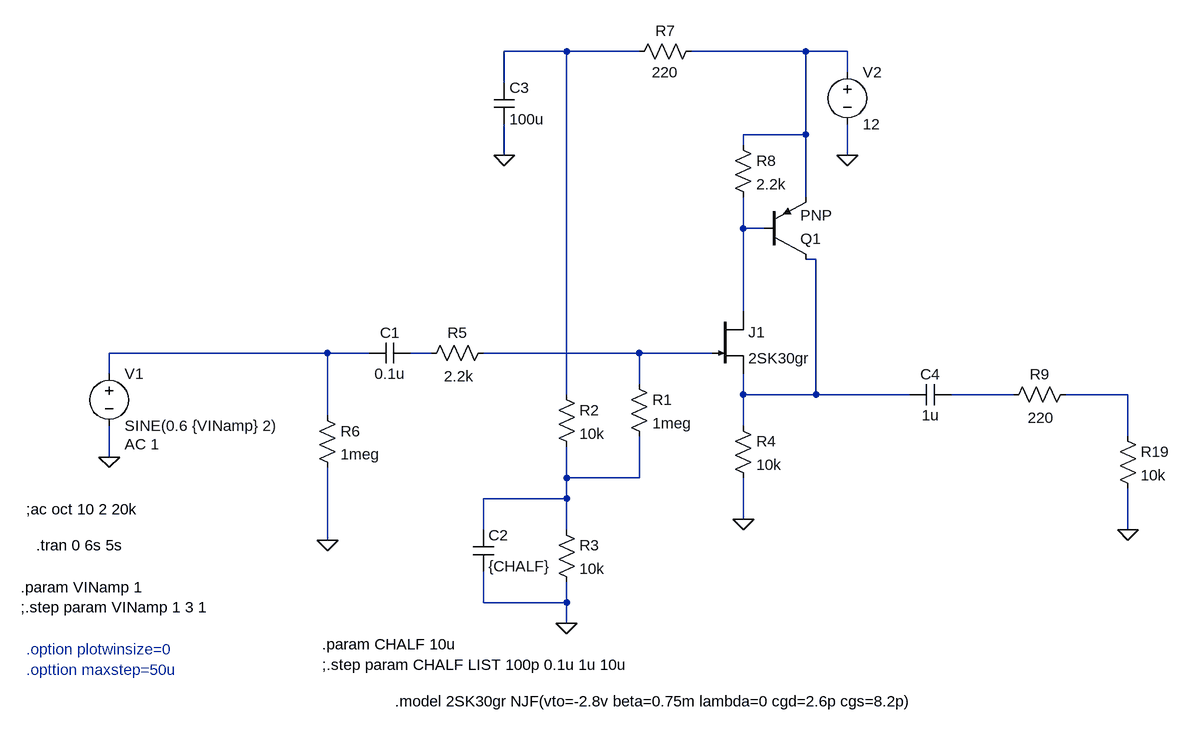
[diagram p0: schematic PTBS-1 Buffer.asc]
PTBS-1 Buffer.asc, the LTspice schematic file:
Version 4
SHEET 1 1708 4196
WIRE -432 1904 -528 1904
WIRE -320 1904 -432 1904
WIRE -64 1904 -240 1904
WIRE 0 1904 -64 1904
WIRE 0 1936 0 1904
WIRE -528 1952 -528 1904
WIRE -64 2032 -64 1904
WIRE -64 2032 -160 2032
WIRE -160 2048 -160 2032
WIRE -528 2064 -528 2016
WIRE 0 2064 0 2016
WIRE -64 2128 -64 2032
WIRE -160 2176 -160 2128
WIRE -128 2176 -160 2176
WIRE -48 2224 -64 2224
WIRE -160 2304 -160 2176
WIRE -800 2368 -1136 2368
WIRE -736 2368 -800 2368
WIRE -640 2368 -672 2368
WIRE -320 2368 -560 2368
WIRE -208 2368 -320 2368
WIRE -1136 2400 -1136 2368
WIRE -320 2416 -320 2368
WIRE -432 2432 -432 1904
WIRE -160 2432 -160 2400
WIRE -48 2432 -48 2224
WIRE -48 2432 -160 2432
WIRE 96 2432 -48 2432
WIRE 256 2432 160 2432
WIRE 432 2432 336 2432
WIRE -800 2464 -800 2368
WIRE -160 2480 -160 2432
WIRE 432 2496 432 2432
WIRE -1136 2528 -1136 2480
WIRE -432 2560 -432 2512
WIRE -320 2560 -320 2496
WIRE -320 2560 -432 2560
WIRE -432 2592 -432 2560
WIRE -432 2592 -560 2592
WIRE -160 2624 -160 2560
WIRE -560 2640 -560 2592
WIRE -432 2640 -432 2592
WIRE 432 2640 432 2576
WIRE -800 2656 -800 2544
WIRE -560 2752 -560 2704
WIRE -432 2752 -432 2720
WIRE -432 2752 -560 2752
WIRE -432 2784 -432 2752
FLAG -160 2624 0
FLAG -432 2784 0
FLAG 0 2064 0
FLAG 432 2640 0
FLAG -1136 2528 0
FLAG -800 2656 0
FLAG -528 2064 0
SYMBOL njf -208 2304 R0
SYMATTR InstName J1
SYMATTR Value 2SK30gr
SYMBOL res -336 2400 R0
SYMATTR InstName R1
SYMATTR Value 1meg
SYMBOL res -448 2416 R0
SYMATTR InstName R2
SYMATTR Value 10k
SYMBOL res -448 2624 R0
SYMATTR InstName R3
SYMATTR Value 10k
SYMBOL res -176 2464 R0
SYMATTR InstName R4
SYMATTR Value 10k
SYMBOL res -544 2352 R90
WINDOW 0 0 56 VBottom 2
WINDOW 3 36 54 VTop 2
SYMATTR InstName R5
SYMATTR Value 2.2k
SYMBOL voltage 0 1920 R0
WINDOW 123 0 0 Left 2
WINDOW 39 0 0 Left 2
SYMATTR InstName V2
SYMATTR Value 12
SYMBOL cap -672 2352 R90
WINDOW 0 0 32 VBottom 2
WINDOW 3 32 32 VTop 2
SYMATTR InstName C1
SYMATTR Value 0.1u
SYMBOL cap -576 2640 R0
SYMATTR InstName C2
SYMATTR Value {CHALF}
SYMBOL res 416 2480 R0
SYMATTR InstName R19
SYMATTR Value 10k
SYMBOL voltage -1136 2384 R0
WINDOW 123 24 124 Left 2
WINDOW 39 0 0 Left 2
SYMATTR Value2 AC 1
SYMATTR InstName V1
SYMATTR Value SINE(0.6 {VINamp} 2)
SYMBOL res -816 2448 R0
SYMATTR InstName R6
SYMATTR Value 1meg
SYMBOL res -224 1888 R90
WINDOW 0 0 56 VBottom 2
WINDOW 3 32 56 VTop 2
SYMATTR InstName R7
SYMATTR Value 220
SYMBOL cap -544 1952 R0
SYMATTR InstName C3
SYMATTR Value 100u
SYMBOL pnp -128 2224 M180
SYMATTR InstName Q1
SYMBOL res -176 2032 R0
SYMATTR InstName R8
SYMATTR Value 2.2k
SYMBOL res 352 2416 R90
WINDOW 0 0 56 VBottom 2
WINDOW 3 36 54 VTop 2
SYMATTR InstName R9
SYMATTR Value 220
SYMBOL cap 160 2416 R90
WINDOW 0 0 32 VBottom 2
WINDOW 3 32 32 VTop 2
SYMATTR InstName C4
SYMATTR Value 1u
TEXT -696 2904 Left 2 !.model 2SK30gr NJF(vto=-2.8v beta=0.75m lambda=0 cgd=2.6p cgs=8.2p)
TEXT -1264 2608 Left 2 !;ac oct 10 2 20k
TEXT -1248 2664 Left 2 !.tran 0 6s 5s
TEXT -1272 2728 Left 2 !.param VINamp 1\n;.step param VINamp 1 3 1
TEXT -1264 2824 Left 2 ;.option plotwinsize=0\n.opttion maxstep=50u
TEXT -808 2816 Left 2 !.param CHALF 10u\n;.step param CHALF LIST 100p 0.1u 1u 10u

The netlist it stands for:
* PTBS-1 Buffer.asc
J1 N003 N007 N004 2SK30gr
R1 N007 N010 1meg
R2 N001 N010 10k
R3 N010 0 10k
R4 N004 0 10k
R5 N007 N006 2.2k
V2 N002 0 12
C1 N006 N005 0.1u
C2 N010 0 {CHALF}
R19 N009 0 10k
V1 N005 0 SINE(0.6 {VINamp} 2) AC 1
R6 N005 0 1meg
R7 N002 N001 220
C3 N001 0 100u
Q1 N004 N003 N002 0 PNP
R8 N002 N003 2.2k
R9 N009 N008 220
C4 N008 N004 1u
.model NPN NPN
.model PNP PNP
.lib standard.bjt
.model NJF NJF
.model PJF PJF
.lib standard.jft
.model 2SK30gr NJF(vto=-2.8v beta=0.75m lambda=0 cgd=2.6p cgs=8.2p)
;ac oct 10 2 20k
.tran 0 6s 5s
.param VINamp 1
;.step param VINamp 1 3 1
* .option plotwinsize=0
* .opttion maxstep=50u
.param CHALF 10u
;.step param CHALF LIST 100p 0.1u 1u 10u
.backanno
.end